# Altium schematic sheet power.SchDoc
size A
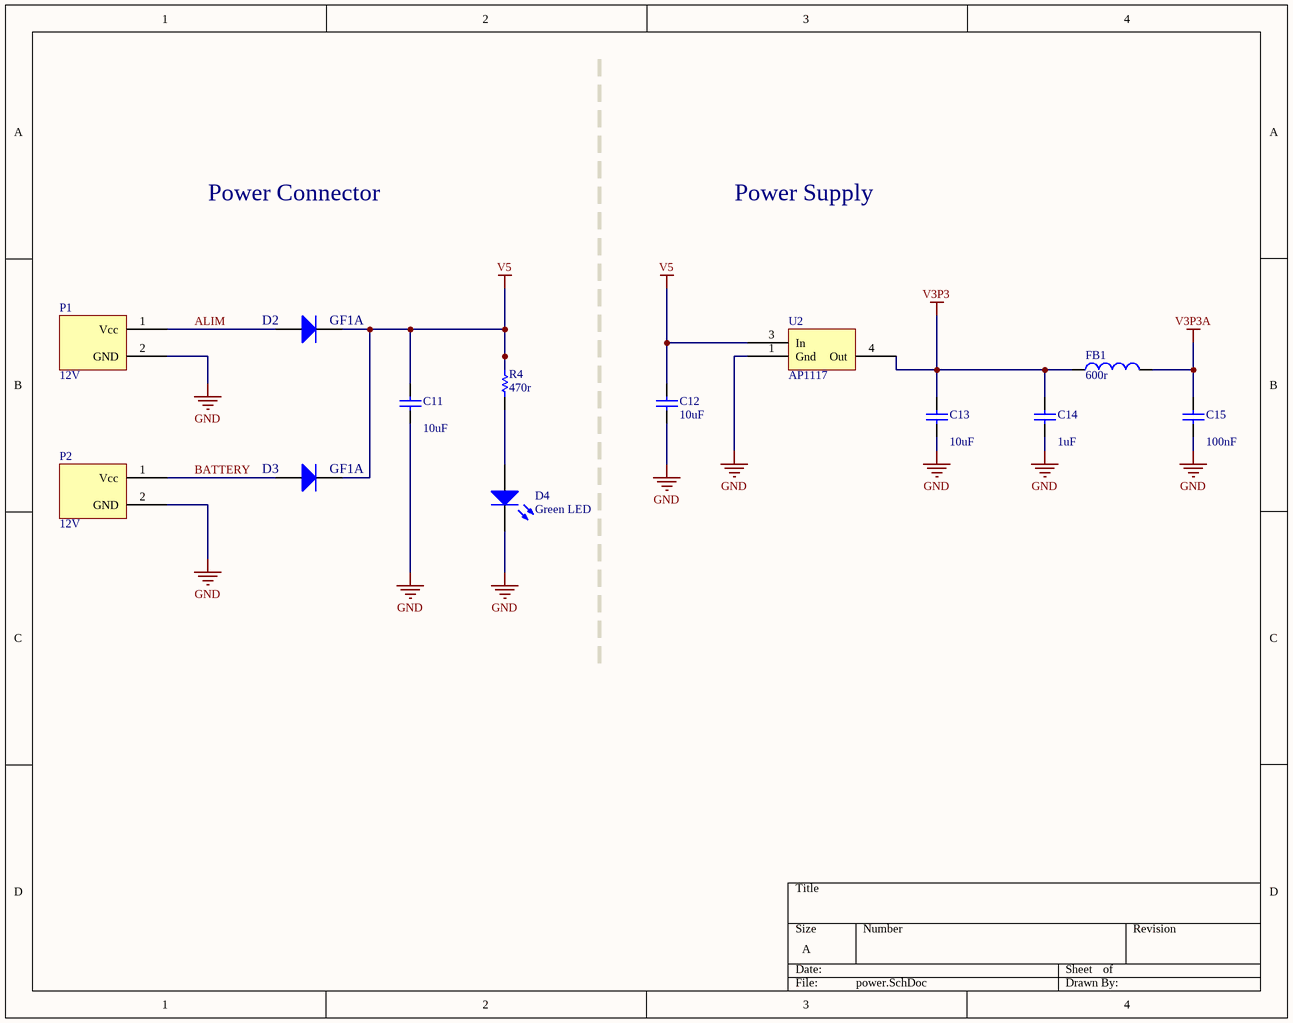
[diagram p0: power.SchDoc]

## Parts
C11  value 10uF  [CAPC2012N]
C12  10uF  [CAPC2012N]
C13  value 10uF  [CAPC2012N]  (hidden comment: Cap)
C14  value 1uF  [CAPC1608N]  (hidden comment: Cap)
C15  value 100nF  [CAPC1608N]  (hidden comment: Cap)
D2  Diode  [SMA/DO-214AC_21]  (value not drawn)
D3  Diode  [SMA/DO-214AC_21]  (value not drawn)
D4  Green LED  [LED 0805]
FB1  value 600r  [INDC1608AN]  (hidden comment: Inductor)
P1  12V  [PHOENIX_1985195]
P2  12V  [PHOENIX_1985195]
R4  470r  [RESC1608N]
U2  AP1117  [TD03B_N]

## Nets
GND: C11.1 C12.1 C13.1 C14.1 C15.1 D4.2(K) P1.2(GND) P2.2(GND) U2.1(Gnd)
V3P3: C13.2 C14.2 FB1.1 U2.4(Out)
V3P3A: C15.2 FB1.2
V5: C11.2 C12.2 D2.2(K) D3.2(K) R4.2 U2.3(In)
ALIM: D2.1(A) P1.1(Vcc)
BATTERY: D3.1(A) P2.1(Vcc)
NetD4_1: D4.1(A) R4.1

## Notes on the sheet
- Power Connector
- Power Supply
- (near D2) D2
- (near D2) GF1A
- (near D3) D3
- (near D3) GF1A

## Library data of the parts
C11-C15 = Cap: Capacitor; Published: 8-Jun-2000; LatestRevisionDate: 17-Jul-2002; LatestRevisionNote: Re-released for DXP Platform.; PackageReference: RAD-0.3; Publisher: Altium Limited; PackageDescription: Radial Cap, Thru-Hole; 2 Leads; 0.3 in Pin Spacing
D2 D3 = Diode: Default Diode; Published: 8-Jun-2000; LatestRevisionDate: 17-Jul-2002; LatestRevisionNote: Re-released for DXP Platform.; PackageVersion: Sep-1996; PackageReference: SMC; Publisher: Altium Limited; PackageDescription: DO-214-AB/SMC; 2 C-Bend Leads; Body 7.9 x 5.9 mm, inc. leads (LxW); Code_JEDEC: DO-214-AB
D4 = LED0: Typical INFRARED GaAs LED; Published: 8-Jun-2000; LatestRevisionDate: 08-Jul-2005; LatestRevisionNote: Mech Layer 1 removed.; PackageReference: LED-0; Publisher: Altium Limited; PackageDescription: LED; 2 Leads
FB1 = Inductor: Code_IEC: 1005; Published: 8-Jun-2000; LatestRevisionDate: 29-May-2009; LatestRevisionNote: IPC-7351 Footprint Added.; PackageReference: 0402-A; Publisher: Altium Limited; PackageDescription: Chip Inductor; Code_JEITA: 0402
R4 = Res1: Resistor; Published: 8-Jun-2000; LatestRevisionDate: 17-Jul-2002; LatestRevisionNote: Re-released for DXP Platform.; PackageReference: AXIAL-0.3; Publisher: Altium Limited; PackageDescription: Axial Device, Thru-Hole; 2 Leads; 0.3 in Pin Spacing